# EAGLE design IMU CAN Speed Converter Board rev1 (EAGLE 9.6.2)
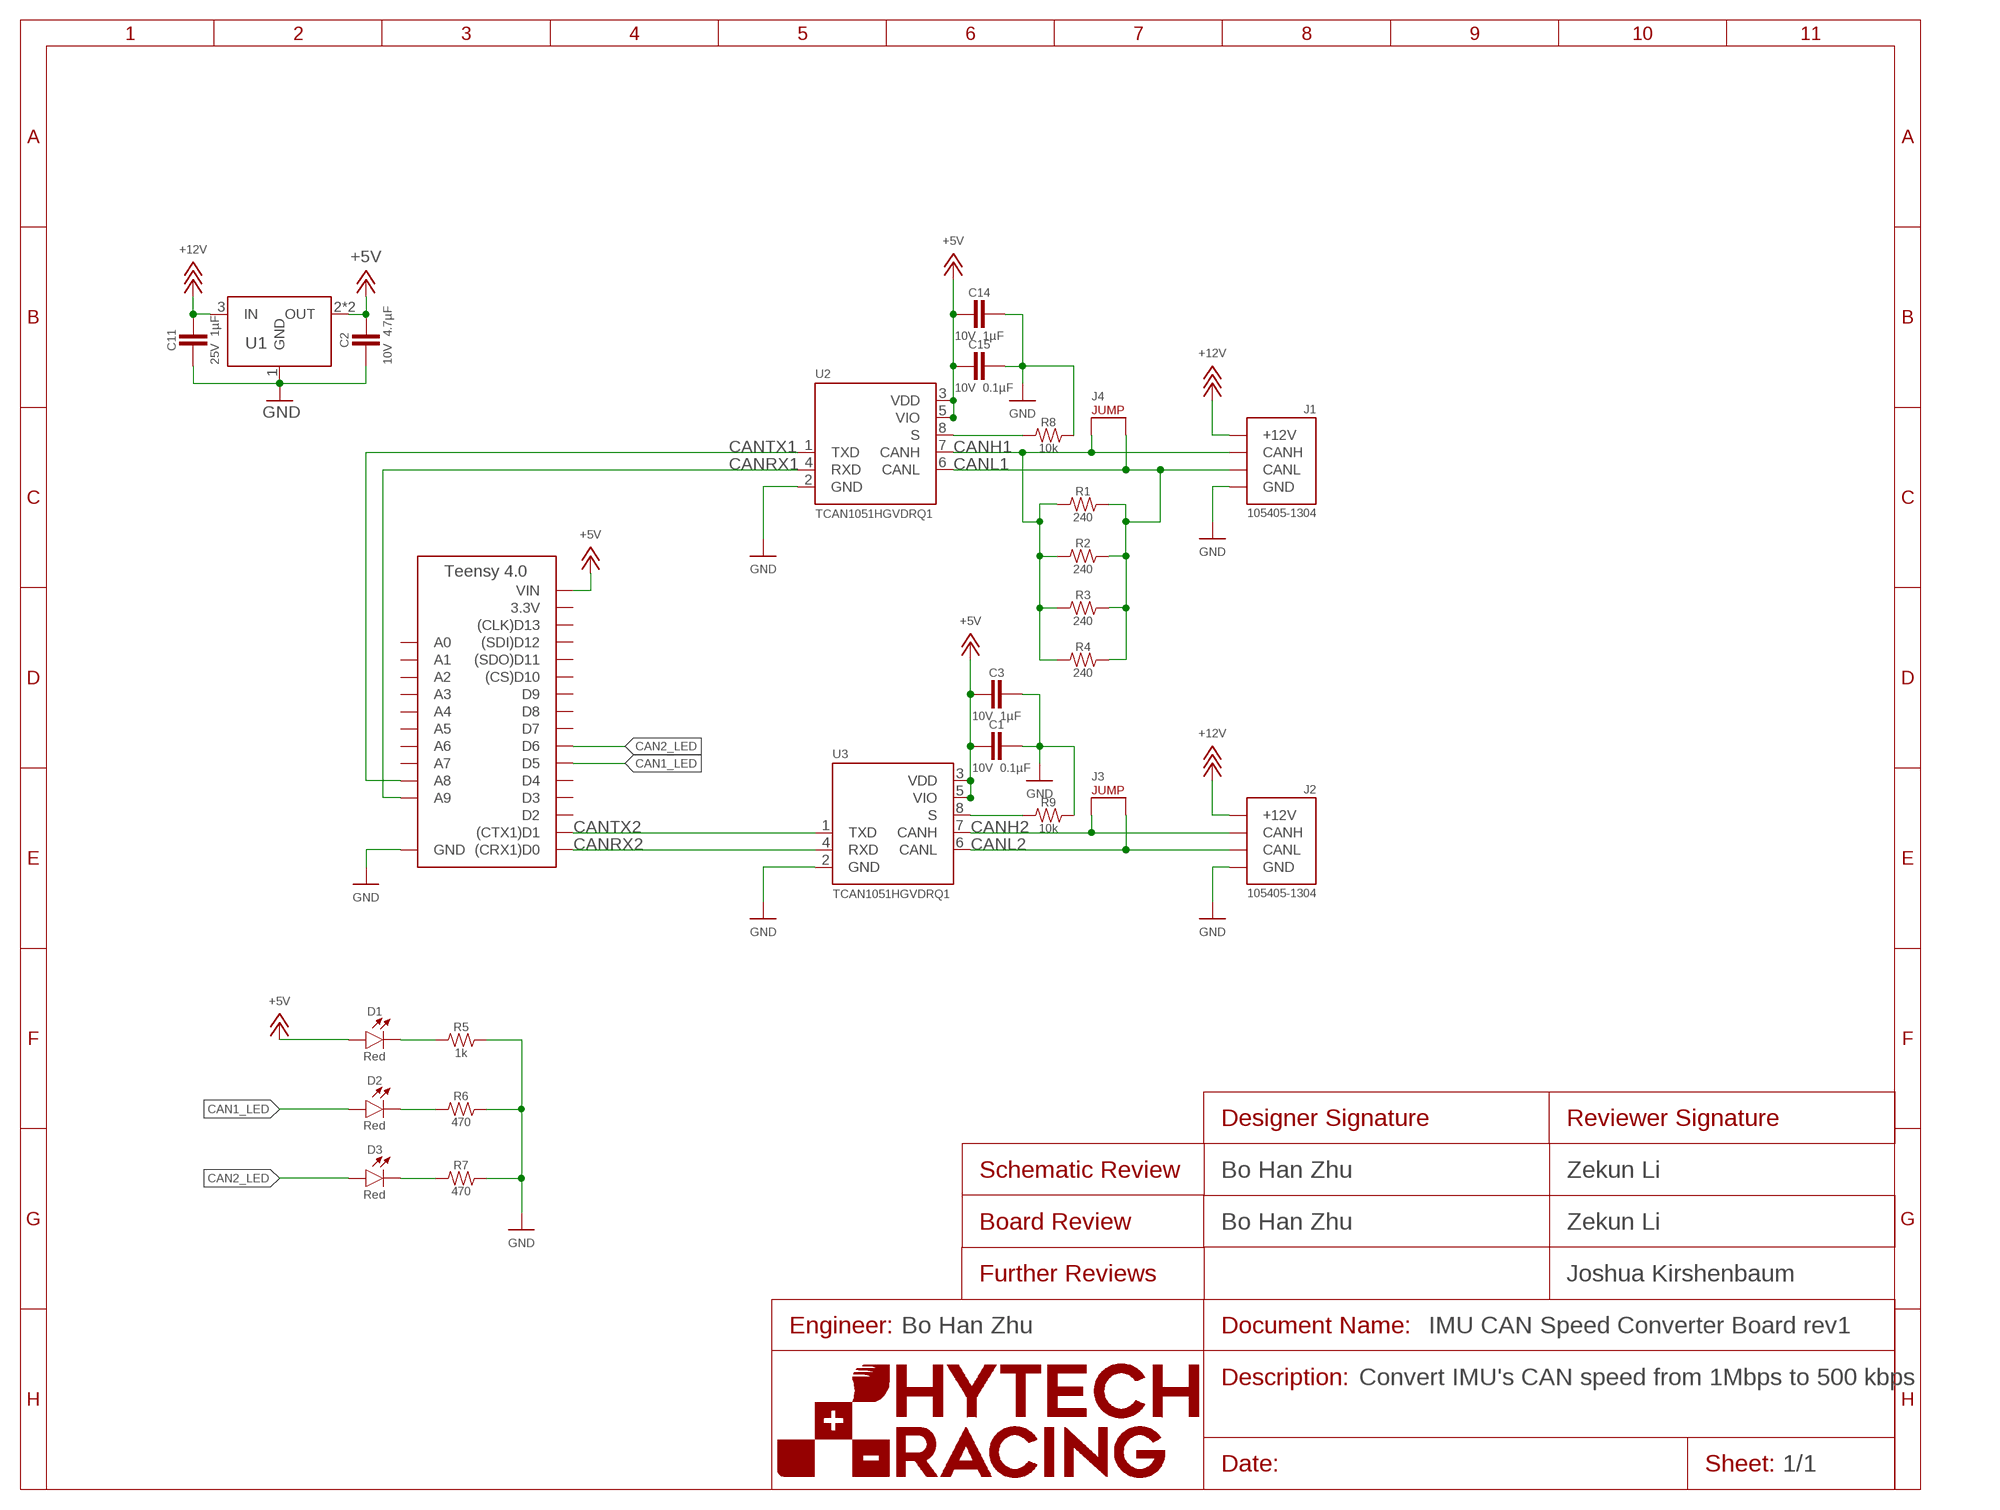
[diagram p0: schematic, sheet 1]
FRAME1 (FRAME): DESCRIPTION_1: Convert IMU's CAN speed from 1Mbps to 500 kbps; DESIGNER_BOARD: Bo Han Zhu; DESIGNER_SCHEMATIC: Bo Han Zhu; ENGINEER: Bo Han Zhu; REVIEWER_BOARD: Zekun Li; REVIEWER_FURTHER: Joshua Kirshenbaum; REVIEWER_SCHEMATIC: Zekun Li

## Parts
A1  TEENSY_4.0  [TEENSY_SHORT]
C1  CAPACITOR_0603_10V_0.1UF  [0603-CAP]
C2  CAPACITOR_0603_10V_4.7UF  [0603-CAP]
C3  CAPACITOR_0603_10V_1UF  [0603-CAP]
C11  CAPACITOR_0603_25V_1UF  [0603-CAP]
C14  CAPACITOR_0603_10V_1UF  [0603-CAP]
C15  CAPACITOR_0603_10V_0.1UF  [0603-CAP]
D1  LED_0603_RED  [0603-LED]
D2  LED_0603_RED  [0603-LED]
D3  LED_0603_RED  [0603-LED]
J1  CONNECTOR-CAN_NF_S_RA_BLACK  [MOLEX_NANOFIT_SMD_RIGHTANGLE_04]
J2  CONNECTOR-CAN_NF_S_RA_BLACK  [MOLEX_NANOFIT_SMD_RIGHTANGLE_04]
J3  JUMPER_1X02_  [1X02]
J4  JUMPER_1X02_  [1X02]
R1  RESISTOR_0603_240  [0603-RES]
R2  RESISTOR_0603_240  [0603-RES]
R3  RESISTOR_0603_240  [0603-RES]
R4  RESISTOR_0603_240  [0603-RES]
R5  RESISTOR_0603_1K  [0603-RES]
R6  RESISTOR_0603_470  [0603-RES]
R7  RESISTOR_0603_470  [0603-RES]
R8  RESISTOR_0603_10K  [0603-RES]
R9  RESISTOR_0603_10K  [0603-RES]
U1  VOLTAGE_REGULATOR_SOT223_5V  [SOT223]
U2  TCAN1051HQV-Q1  [SOIC-08(NARROW,0.15")]
U3  TCAN1051HQV-Q1  [SOIC-08(NARROW,0.15")]

## Nets
+5V: A1.VIN C1.2 C2.1 C3.2 C14.2 C15.2 D1.2(A) U1.2(OUT) U1.4(OUT) U2.3(VDD) U2.5(VIO) U3.3(VDD) U3.5(VIO)
+12V: C11.1 J1.1(+12V) J2.1(+12V) U1.3(IN)
CAN1_LED: A1.D5 D2.2(A)
CAN2_LED: A1.D6 D3.2(A)
CANH1: J1.4(CANH) J4.1 R1.1 R2.1 R3.1 R4.1 U2.7(CANH)
CANH2: J2.4(CANH) J3.1 U3.7(CANH)
CANL1: J1.3(CANL) J4.2 R1.2 R2.2 R3.2 R4.2 U2.6(CANL)
CANL2: J2.3(CANL) J3.2 U3.6(CANL)
CANRX1: A1.D23(A9) U2.4(RXD)
CANRX2: A1.D0((CRX1)D0) U3.4(RXD)
CANTX1: A1.D22(A8) U2.1(TXD)
CANTX2: A1.D1((CTX1)D1) U3.1(TXD)
GND: A1.AGND/GND(GND) A1.GND C1.1 C2.2 C3.1 C11.2 C14.1 C15.1 J1.2(GND) J2.2(GND) R5.2 R6.2 R7.2 R8.2 R9.2 U1.1(GND) U2.2(GND) U3.2(GND)
N$1: D1.1(C) R5.1
N$2: D2.1(C) R6.1
N$3: D3.1(C) R7.1
N$4: R9.1 U3.8(S)
N$5: R8.1 U2.8(S)
Unconnected: A1.D2 A1.D3 A1.D4 A1.D7 A1.D8 A1.D9 A1.D10((CS)D10) A1.D11((SDO)D11) A1.D12((SDI)D12) A1.D13((CLK)D13) A1.D14(A0) A1.D15(A1) A1.D16(A2) A1.D17(A3) A1.D18(A4) A1.D19(A5) A1.D20(A6) A1.D21(A7)

## Power pins joined to a net without a drawn wire
3.3V: A1.3.3V

## Library data of the parts
A1 = HyTechDevices:TEENSY_4.0: Teensy 4.0 Datasheet <https://www.pjrc.com/store/teensy40.html>
C1 C15 = HyTechDevices:CAPACITOR_?_*: Capacitor, Non-Polarized VJ...1BC Series Datasheet <https://www.mouser.com/datasheet/2/427/vjw1bcbascomseries-1762447.pdf> Samsung Datasheet <https://www.mouser.com/datasheet/2/585/MLCC-1837944.pdf> Walsin Datasheet <https://www.mouser.com/datasheet/2/210/WTC_MLCC_General_Purpose-1534899.pdf> GRM188R61A226ME15D <https://www.mouser.com/datasheet/2/281/1/GRM188R61A226ME15_02A-1985787.pdf> GRM188R61E106MA73D <https://www.mouser.com/datasheet/2/281/1/GRM188R61E106MA73_01A-1985806.pdf> 885012006013 <https://www.mouser.com/datasheet/2/445/885012006013-1726946.pdf> 2220Y6300105KXTWS2 <https://www.mouser.com/datasheet/2/218/SMD_High_and_Std_StackiCap_P62-1825512.pdf> Yageo Class 2, X5R <https://www.mouser.com/datasheet/2/447/UPY_GPHC_X5R_4V_to_50V_26-1827097.pdf> TDK C Series <https://www.mouser.com/ProductDetail/TDK/C3216X5R1V226M160AC?qs=%2Fha2pyFadujbcx9jh7lYl%2F4NeMoXFhdc8AqVWNq4wW6M2y7zl6GzBuhgtI0ngznN> AVX Automotive MLCC <https://www.mouser.com/datasheet/2/40/AutoMLCC-777028.pdf> KEMET X7R Series <https://www.mouser.com/datasheet/2/212/KEM_C1002_X7R_SMD-1102033.pdf>; CAPACITANCE: 0.1µF; DKPN: 720-1688-1-ND; MANUFACTURER: Vishay Vitramon; MOPN: 77-VJ0603Y104JXQPBC; MPN: VJ0603Y104JXQPW1BC; TOLERANCE: 5%; VOLTAGE: 10V
C2 = HyTechDevices:CAPACITOR_?_*: Capacitor, Non-Polarized VJ...1BC Series Datasheet <https://www.mouser.com/datasheet/2/427/vjw1bcbascomseries-1762447.pdf> Samsung Datasheet <https://www.mouser.com/datasheet/2/585/MLCC-1837944.pdf> Walsin Datasheet <https://www.mouser.com/datasheet/2/210/WTC_MLCC_General_Purpose-1534899.pdf> GRM188R61A226ME15D <https://www.mouser.com/datasheet/2/281/1/GRM188R61A226ME15_02A-1985787.pdf> GRM188R61E106MA73D <https://www.mouser.com/datasheet/2/281/1/GRM188R61E106MA73_01A-1985806.pdf> 885012006013 <https://www.mouser.com/datasheet/2/445/885012006013-1726946.pdf> 2220Y6300105KXTWS2 <https://www.mouser.com/datasheet/2/218/SMD_High_and_Std_StackiCap_P62-1825512.pdf> Yageo Class 2, X5R <https://www.mouser.com/datasheet/2/447/UPY_GPHC_X5R_4V_to_50V_26-1827097.pdf> TDK C Series <https://www.mouser.com/ProductDetail/TDK/C3216X5R1V226M160AC?qs=%2Fha2pyFadujbcx9jh7lYl%2F4NeMoXFhdc8AqVWNq4wW6M2y7zl6GzBuhgtI0ngznN> AVX Automotive MLCC <https://www.mouser.com/datasheet/2/40/AutoMLCC-777028.pdf> KEMET X7R Series <https://www.mouser.com/datasheet/2/212/KEM_C1002_X7R_SMD-1102033.pdf>; CAPACITANCE: 4.7µF; DKPN: 1276-1044-1-ND; MANUFACTURER: Samsung Electro-Mechanics; MOPN: 187-CL10A475KP8NNNC; MPN: CL10A475KP8NNNC; TOLERANCE: 10%; VOLTAGE: 10V
C3 C14 = HyTechDevices:CAPACITOR_?_*: Capacitor, Non-Polarized VJ...1BC Series Datasheet <https://www.mouser.com/datasheet/2/427/vjw1bcbascomseries-1762447.pdf> Samsung Datasheet <https://www.mouser.com/datasheet/2/585/MLCC-1837944.pdf> Walsin Datasheet <https://www.mouser.com/datasheet/2/210/WTC_MLCC_General_Purpose-1534899.pdf> GRM188R61A226ME15D <https://www.mouser.com/datasheet/2/281/1/GRM188R61A226ME15_02A-1985787.pdf> GRM188R61E106MA73D <https://www.mouser.com/datasheet/2/281/1/GRM188R61E106MA73_01A-1985806.pdf> 885012006013 <https://www.mouser.com/datasheet/2/445/885012006013-1726946.pdf> 2220Y6300105KXTWS2 <https://www.mouser.com/datasheet/2/218/SMD_High_and_Std_StackiCap_P62-1825512.pdf> Yageo Class 2, X5R <https://www.mouser.com/datasheet/2/447/UPY_GPHC_X5R_4V_to_50V_26-1827097.pdf> TDK C Series <https://www.mouser.com/ProductDetail/TDK/C3216X5R1V226M160AC?qs=%2Fha2pyFadujbcx9jh7lYl%2F4NeMoXFhdc8AqVWNq4wW6M2y7zl6GzBuhgtI0ngznN> AVX Automotive MLCC <https://www.mouser.com/datasheet/2/40/AutoMLCC-777028.pdf> KEMET X7R Series <https://www.mouser.com/datasheet/2/212/KEM_C1002_X7R_SMD-1102033.pdf>; CAPACITANCE: 1µF; DKPN: 311-1796-1-ND; MANUFACTURER: Yageo; MOPN: 603-CC603KRX7R6BB105; MPN: CC0603KRX7R6BB105; TOLERANCE: 10%; VOLTAGE: 10V
C11 = HyTechDevices:CAPACITOR_?_*: Capacitor, Non-Polarized VJ...1BC Series Datasheet <https://www.mouser.com/datasheet/2/427/vjw1bcbascomseries-1762447.pdf> Samsung Datasheet <https://www.mouser.com/datasheet/2/585/MLCC-1837944.pdf> Walsin Datasheet <https://www.mouser.com/datasheet/2/210/WTC_MLCC_General_Purpose-1534899.pdf> GRM188R61A226ME15D <https://www.mouser.com/datasheet/2/281/1/GRM188R61A226ME15_02A-1985787.pdf> GRM188R61E106MA73D <https://www.mouser.com/datasheet/2/281/1/GRM188R61E106MA73_01A-1985806.pdf> 885012006013 <https://www.mouser.com/datasheet/2/445/885012006013-1726946.pdf> 2220Y6300105KXTWS2 <https://www.mouser.com/datasheet/2/218/SMD_High_and_Std_StackiCap_P62-1825512.pdf> Yageo Class 2, X5R <https://www.mouser.com/datasheet/2/447/UPY_GPHC_X5R_4V_to_50V_26-1827097.pdf> TDK C Series <https://www.mouser.com/ProductDetail/TDK/C3216X5R1V226M160AC?qs=%2Fha2pyFadujbcx9jh7lYl%2F4NeMoXFhdc8AqVWNq4wW6M2y7zl6GzBuhgtI0ngznN> AVX Automotive MLCC <https://www.mouser.com/datasheet/2/40/AutoMLCC-777028.pdf> KEMET X7R Series <https://www.mouser.com/datasheet/2/212/KEM_C1002_X7R_SMD-1102033.pdf>; CAPACITANCE: 1µF; DKPN: 1276-1184-1-ND; MANUFACTURER: Samsung Electro-Mechanics; MOPN: 187-CL10B105KA8NNNC; MPN: CL10B105KA8NNNC; TOLERANCE: 10%; VOLTAGE: 25V
D1-D3 = HyTechDevices:LED_?_*: LED Blue <https://www.mouser.com/datasheet/2/216/APT1608VBC_D-246010.pdf> Green <https://www.mouser.com/datasheet/2/216/APT1608ZGCK-1173388.pdf> Orange <https://www.mouser.com/datasheet/2/216/APT1608SECK-6197.pdf> Red <https://www.mouser.com/datasheet/2/216/APT1608SECK-J3-PRV-1173336.pdf> White <https://www.mouser.com/datasheet/2/50/SM0603UWC-880813.pdf> Yellow <https://www.mouser.com/datasheet/2/216/APT1608SYCK-J3-PRV-1173311.pdf>; COLOR: Red; DKPN: 754-1786-1-ND; MANUFACTURER: Kingbright; MOPN: 604-APT1608SECKJ3PRV; MPN: APT1608SECK/J3-PRV
J1 J2 = HyTechDevices:CONNECTOR-CAN_?_*: HyTech CAN Connector; MANUFACTURER: Molex; MPN: 105405-1304
J3 J4 = HyTechDevices:JUMPER_?_*: 2 Pin Connector
R1-R4 = HyTechDevices:RESISTOR_?_*: Resistor PWR163 Series <https://www.mouser.com/datasheet/2/54/pwr163-777985.pdf> AC Series <https://www.mouser.com/datasheet/2/447/Yageo_PYu_AC_51_RoHS_L_7_1714230-1874691.pdf> PU Series <https://www.mouser.com/datasheet/2/447/PYu-PU_51_RoHS_L_6-1504619.pdf> ERA Series <https://www.mouser.com/datasheet/2/315/AOA0000C307-1149632.pdf> PWR263 Series <https://www.mouser.com/datasheet/2/54/pwr263s_35-778069.pdf> RC Series <https://www.mouser.com/datasheet/2/447/Yageo_03_18_2021_PYu_RC_Group_51_RoHS_L_11-2199992.pdf> ERJ PB3, PB6 Series <https://www.mouser.com/datasheet/2/315/AOA0000C328-1530132.pdf> ERJ PA2, P03, PA3, P06, P08, P14 Series <https://www.mouser.com/datasheet/2/315/AOA0000C331-1141874.pdf>; DKPN: 311-240HRCT-ND; MANUFACTURER: Yageo; MOPN: 603-RC0603FR-07240RL; MPN: RC0603FR-07240RL; POWER: 0.1W; RESISTANCE: 240; TOLERANCE: 1%; VOLTAGE_CONTINUOUS: 4.90V; VOLTAGE_MAX: 75V
R5 = HyTechDevices:RESISTOR_?_*: Resistor PWR163 Series <https://www.mouser.com/datasheet/2/54/pwr163-777985.pdf> AC Series <https://www.mouser.com/datasheet/2/447/Yageo_PYu_AC_51_RoHS_L_7_1714230-1874691.pdf> PU Series <https://www.mouser.com/datasheet/2/447/PYu-PU_51_RoHS_L_6-1504619.pdf> ERA Series <https://www.mouser.com/datasheet/2/315/AOA0000C307-1149632.pdf> PWR263 Series <https://www.mouser.com/datasheet/2/54/pwr263s_35-778069.pdf> RC Series <https://www.mouser.com/datasheet/2/447/Yageo_03_18_2021_PYu_RC_Group_51_RoHS_L_11-2199992.pdf> ERJ PB3, PB6 Series <https://www.mouser.com/datasheet/2/315/AOA0000C328-1530132.pdf> ERJ PA2, P03, PA3, P06, P08, P14 Series <https://www.mouser.com/datasheet/2/315/AOA0000C331-1141874.pdf>; DKPN: 311-1.00KHRCT-ND; MANUFACTURER: Yageo; MOPN: 603-RC0603FR-071KL; MPN: RC0603FR-071KL; POWER: 0.1W; RESISTANCE: 1k; TOLERANCE: 1%; VOLTAGE_CONTINUOUS: 10.00V; VOLTAGE_MAX: 75V
R6 R7 = HyTechDevices:RESISTOR_?_*: Resistor PWR163 Series <https://www.mouser.com/datasheet/2/54/pwr163-777985.pdf> AC Series <https://www.mouser.com/datasheet/2/447/Yageo_PYu_AC_51_RoHS_L_7_1714230-1874691.pdf> PU Series <https://www.mouser.com/datasheet/2/447/PYu-PU_51_RoHS_L_6-1504619.pdf> ERA Series <https://www.mouser.com/datasheet/2/315/AOA0000C307-1149632.pdf> PWR263 Series <https://www.mouser.com/datasheet/2/54/pwr263s_35-778069.pdf> RC Series <https://www.mouser.com/datasheet/2/447/Yageo_03_18_2021_PYu_RC_Group_51_RoHS_L_11-2199992.pdf> ERJ PB3, PB6 Series <https://www.mouser.com/datasheet/2/315/AOA0000C328-1530132.pdf> ERJ PA2, P03, PA3, P06, P08, P14 Series <https://www.mouser.com/datasheet/2/315/AOA0000C331-1141874.pdf>; DKPN: P470BYCT-ND; MANUFACTURER: Panasonic Electronic Components; MOPN: 667-ERJ-PA3F4700V; MPN: ERJ-PA3F4700V; POWER: 0.25W; RESISTANCE: 470; TOLERANCE: 1%; VOLTAGE_CONTINUOUS: 10.84V; VOLTAGE_MAX: 150V
R8 R9 = HyTechDevices:RESISTOR_?_*: Resistor PWR163 Series <https://www.mouser.com/datasheet/2/54/pwr163-777985.pdf> AC Series <https://www.mouser.com/datasheet/2/447/Yageo_PYu_AC_51_RoHS_L_7_1714230-1874691.pdf> PU Series <https://www.mouser.com/datasheet/2/447/PYu-PU_51_RoHS_L_6-1504619.pdf> ERA Series <https://www.mouser.com/datasheet/2/315/AOA0000C307-1149632.pdf> PWR263 Series <https://www.mouser.com/datasheet/2/54/pwr263s_35-778069.pdf> RC Series <https://www.mouser.com/datasheet/2/447/Yageo_03_18_2021_PYu_RC_Group_51_RoHS_L_11-2199992.pdf> ERJ PB3, PB6 Series <https://www.mouser.com/datasheet/2/315/AOA0000C328-1530132.pdf> ERJ PA2, P03, PA3, P06, P08, P14 Series <https://www.mouser.com/datasheet/2/315/AOA0000C331-1141874.pdf>; DKPN: 311-10.0KHRCT-ND; MANUFACTURER: Yageo; MOPN: 603-RC0603FR-0710KL; MPN: RC0603FR-0710KL; POWER: 0.1W; RESISTANCE: 10k; TOLERANCE: 1%; VOLTAGE_CONTINUOUS: 31.62V; VOLTAGE_MAX: 75V
U1 = HyTechDevices:VOLTAGE_REGULATOR_?_*: Voltage Regulators LDL1117S50R Datasheet <https://www.mouser.com/datasheet/2/389/dm00366442-1799212.pdf> NCP785AH120T1G <https://www.mouser.com/datasheet/2/308/NCP785A_D-1812704.pdf>; DKPN: 497-17240-1-ND; MANUFACTURER: STMicroelectronics; MOPN: 511-LDL1117S50R; MPN: LDL1117S50R
U2 U3 = HyTechDevices:TCAN1051*V-Q1: TCAN1051*V Can Tranciever Datasheet <https://www.ti.com/lit/ds/symlink/tcan1051hgv-q1.pdf?HQS=dis-mous-null-mousermode-dsf-pf-null-wwe&ts=1610765132518&ref_url=https%253A%252F%252Fwww.mouser.com%252Ff>; DKPN: 296-49935-1-ND; MANUFACTURER: Texas Instruments; MOPN: 595-TCAN1051HGVDQ1; MPN: TCAN1051HGVDRQ1

## Board
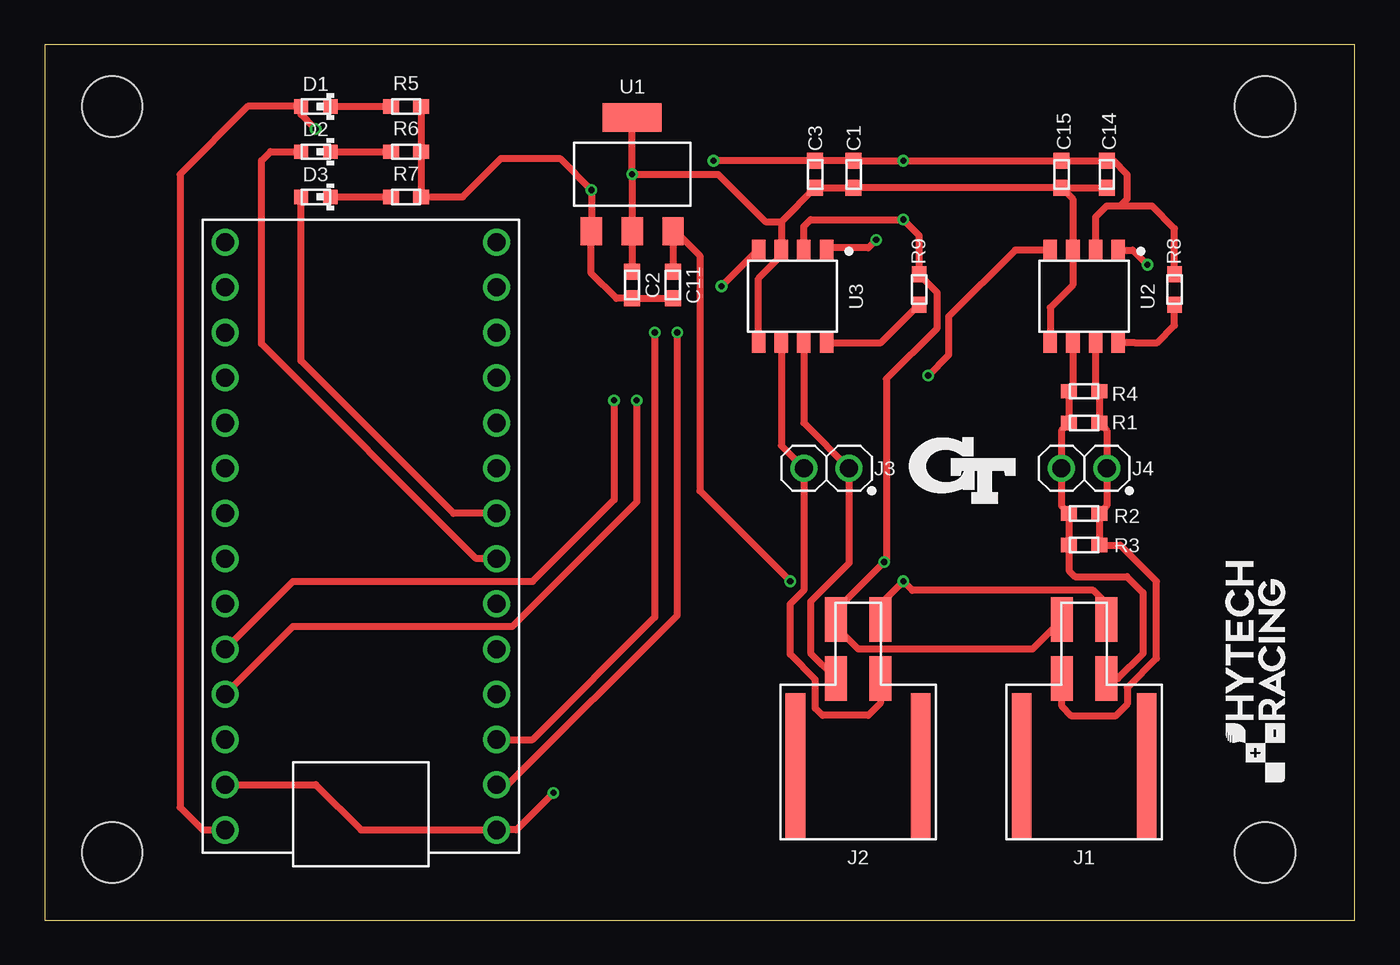
[diagram p1: board, top side]
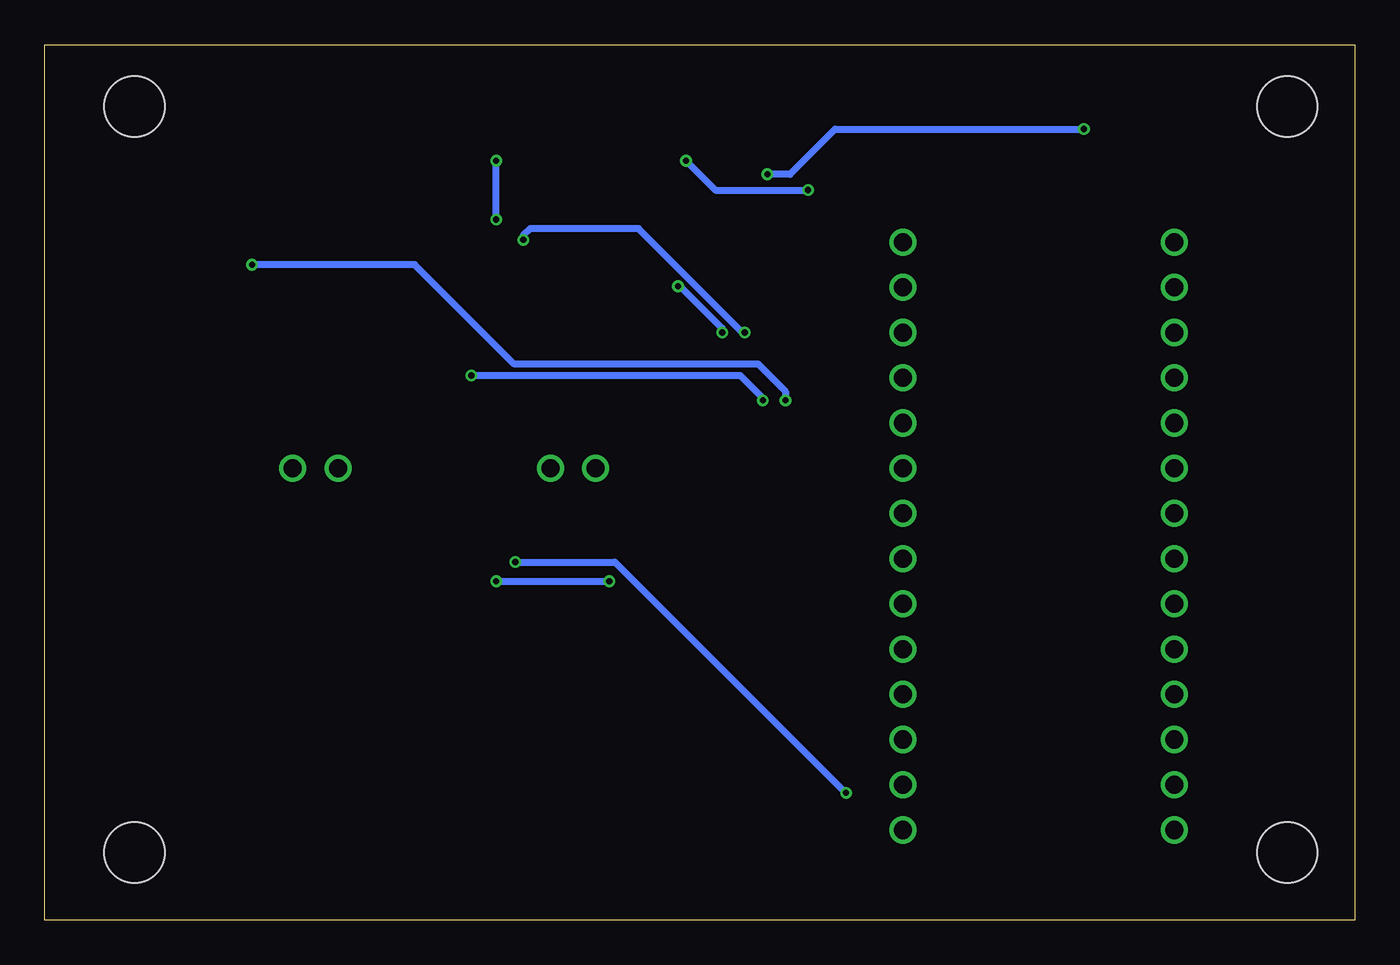
[diagram p2: board, bottom side, seen from below]

Size 73.64 x 49.2 mm. Coordinates in mm from the lower left corner, seen from the top.
Outline: 0,0 73.64,0 73.64,49.2 0,49.2 0,0
Copper layers (1*16): Top 0.035mm / dielectric 1.53mm / Bottom 0.035mm
Design rules "JLCPCB (2 Layer)": minimum track width 5mil, minimum drill 0.3mm, track to track 5mil, track to pad 5mil, pad to pad 5mil, via to via 20mil, smd to smd 5mil, copper to edge 0.2mm, drill to drill 21mil, minimum pad ring 6mil, minimum via ring 6mil, stop-mask expansion 6mil, vias tented up to drill 30mil, thermal gap 10mil

### Footprints (pad centres in the part's own frame; a part is rotated, then mirrored left to right if it is on the bottom)
TEENSY_SHORT = drill 1.016: 3.3V 0,5.08; AGND/GND 0,2.54; D0 15.24,2.54; D1 15.24,5.08; D2 15.24,7.62; D3 15.24,10.16; D4 15.24,12.7; D5 15.24,15.24; D6 15.24,17.78; D7 15.24,20.32; D8 15.24,22.86; D9 15.24,25.4; D10 15.24,27.94; D11 15.24,30.48; D12 15.24,33.02; D13 0,33.02; D14 0,30.48; D15 0,27.94; D16 0,25.4; D17 0,22.86; D18 0,20.32; D19 0,17.78; D20 0,15.24; D21 0,12.7; D22 0,10.16; D23 0,7.62; GND 15.24,0; VIN 0,0
0603-CAP = smd 0.9 x 0.9: 1 -0.75,0; 2 0.75,0
0603-LED = smd 0.8 x 0.8: 1 -0.825,0; 2 0.825,0
MOLEX_NANOFIT_SMD_RIGHTANGLE_04 = smd 1.24 x 2.5: 1 1.25,1.65; 2 -1.25,1.65; 3 1.25,-1.65; 4 -1.25,-1.65 | smd 1.1 x 8.2: PAD1 -3.52,-6.58; PAD@1 3.52,-6.58
1X02 = drill 1.016: 1 -1.27,0; 2 1.27,0
0603-RES = smd 0.9 x 0.8: 1 -0.85,0; 2 0.85,0
SOT223 = smd 1.2 x 1.6: 1 -2.3,-3.2; 2 0,-3.2; 3 2.3,-3.2 | smd 3.3 x 1.6: 4 0,3.2
SOIC-08(NARROW,0.15") = smd 0.762 x 1.143: 1 -1.905,-2.603; 2 -0.635,-2.603; 3 0.635,-2.603; 4 1.905,-2.603; 5 1.905,2.603; 6 0.635,2.603; 7 -0.635,2.603; 8 -1.905,2.603
MOUNTING_M3 = hole 3.4: 0,0

### Placement (x,y rotation side)
A1  10.16,5.08 0 top
C1  45.47,41.91 270 top
C2  33.02,35.69 270 top
C3  43.31,41.91 270 top
C11  35.31,35.69 270 top
C14  59.69,41.91 270 top
C15  57.15,41.91 270 top
D1  15.24,45.72 180 top
D2  15.24,43.18 180 top
D3  15.24,40.64 180 top
J1  58.42,15.24 0 top
J2  45.72,15.24 0 top
J3  43.94,25.4 180 top
J4  58.42,25.4 180 top
R1  58.42,27.94 180 top
R2  58.42,22.86 180 top
R3  58.42,21.08 180 top
R4  58.42,29.72 180 top
R5  20.32,45.72 0 top
R6  20.32,43.18 0 top
R7  20.32,40.64 0 top
R8  63.5,35.43 90 top
R9  49.15,35.43 90 top
U1  33.02,41.91 0 top
U2  58.42,35.05 180 top
U3  42.04,35.05 180 top
U$1  [MOUNTING_M3]  68.58,3.81 0 top
U$2  [MOUNTING_M3]  3.81,45.72 0 top
U$3  [LOGO_HYTECH_0.5"]  69.85,7.62 90 top
U$4  [MOUNTING_M3]  3.81,3.81 0 top
U$5  [MOUNTING_M3]  68.58,45.72 0 top
U$6  [LOGO_GT_0.25"]  51.56,25.27 0 top

### Tracks (layer width: path | path; a pad name or v marks a point on that pad's centre or on a via)
+5V  (via drill 0.35)
  Top 0.381: C15.2 C14.2 | C15.2 57.78,40.52 U2.3 57.78,35.69 56.52,34.42 U2.5 | 41.4,39.26 C3.2 C1.2 C15.2 | 41.4,39.26 U3.3 41.56,37.5 40.13,36.07 U3.5 | A1.VIN 8.89,5.08 7.62,6.35 7.62,41.91 11.43,45.72 D1.2 14.41,45.27 v15.24,44.45 | v33.02,41.91 U1.4 | v33.02,41.91 U1.2 C2.1 | v33.02,41.91 37.85,41.91 40.5,39.26 41.4,39.26
  Bottom 0.381: v15.24,44.45 29.21,44.45 31.75,41.91 v33.02,41.91
+12V  (via drill 0.35)
  Top 0.381: J2.1 46.97,17.76 v48.26,19.05 48.77,18.54 58.93,18.54 59.69,17.78 59.67,17.76 J1.1 | v41.91,19.05 36.83,24.13 36.83,37.34 35.46,38.71 U1.3 35.32,36.45 C11.1
  Bottom 0.381: v48.26,19.05 v41.91,19.05
CAN1_LED
  Top 0.381: A1.D5 24.26,20.32 12.19,32.38 12.19,42.67 12.7,43.18 D2.2
CAN2_LED
  Top 0.381: A1.D6 22.99,22.86 14.41,31.43 D3.2
CANH1
  Top 0.381: U2.7 59.05,29.93 R4.1 R1.1 59.69,27.52 J4.1 59.69,23.28 R2.1 R3.1 60.45,21.08 62.48,19.05 62.48,14.72 60.84,13.08 60.84,12.15 60.17,11.48 57.71,11.48 57.17,12.02 J1.4
CANH2
  Top 0.381: U3.7 42.67,27.94 J3.1 45.21,20.07 43.05,17.91 43.05,15.01 J2.4
CANL1
  Top 0.381: U2.6 57.78,29.93 R4.2 R1.2 57.15,27.52 J4.2 57.15,23.28 R2.2 R3.2 57.57,19.65 57.91,19.3 60.83,19.3 61.72,18.41 61.72,14.99 60.33,13.59 J1.3
CANL2
  Top 0.381: U3.6 41.4,26.67 J3.2 42.67,18.54 41.91,17.78 41.91,14.94 43.32,13.53 43.32,11.91 43.72,11.51 46.29,11.51 46.97,12.19 J2.3
CANRX1  (via drill 0.35)
  Top 0.381: A1.D23 13.97,16.51 26.29,16.51 33.27,23.5 v33.27,29.21 | v49.66,30.61 50.8,31.75 50.8,33.91 54.55,37.66 U2.4
  Bottom 0.381: v33.27,29.21 33.27,29.34 34.54,30.61 v49.66,30.61
CANRX2  (via drill 0.35)
  Top 0.381: A1.D0 26.04,7.62 35.56,17.14 v35.56,33.02 | v38.04,35.62 40.07,37.66 U3.4
  Bottom 0.381: v35.56,33.02 35.56,33.27 37.97,35.69 v38.04,35.62
CANTX1  (via drill 0.35)
  Top 0.381: A1.D22 13.97,19.05 27.43,19.05 32,23.62 v32,29.21 | U2.1 61.15,37.66 v61.98,36.83
  Bottom 0.381: v32,29.21 32,29.72 33.53,31.24 47.24,31.24 52.83,36.83 v61.98,36.83
CANTX2  (via drill 0.35)
  Top 0.381: A1.D1 27.43,10.16 34.29,17.02 v34.29,33.02 | U3.1 44.07,37.78 46.29,37.78 v46.74,38.23
  Bottom 0.381: v34.29,33.02 34.42,33.02 40.26,38.86 46.35,38.86 46.74,38.48 v46.74,38.23
GND  (via drill 0.35)
  Top 0.381: J1.2 55.53,15.25 45.71,15.25 44.47,16.49 J2.2 44.47,17.42 v47.18,20.13 47.31,20.26 47.31,30.42 50.16,33.27 50.16,35.27 R9.2 49.15,38.48 v48.26,39.37 43.05,39.37 42.67,38.99 U3.2 | 60.45,40.13 60.83,40.51 60.83,41.91 60.08,42.66 C14.1 C15.1 57.14,42.67 v48.26,42.67 48.25,42.66 C1.1 C3.1 37.6,42.66 v37.59,42.67 | 60.45,40.13 59.69,40.13 59.05,39.5 U2.2 | 60.45,40.13 62.23,40.13 63.5,38.86 R8.2 | R5.2 R6.2 R7.2 23.5,40.64 25.65,42.8 28.96,42.8 v30.73,41.02 30.73,38.72 U1.1 30.72,36.35 32.13,34.94 C2.2 C11.2 | A1.AGND/GND 15.24,7.62 17.78,5.08 A1.GND 26.52,5.08 v28.6,7.16
  Bottom 0.381: v47.18,20.13 41.59,20.13 28.63,7.16 v28.6,7.16 | v48.26,39.37 v48.26,42.67 | v37.59,42.67 35.94,41.02 v30.73,41.02
N$1
  Top 0.381: D1.1 R5.1
N$2
  Top 0.381: D2.1 R6.1
N$3
  Top 0.381: D3.1 R7.1
N$4
  Top 0.381: U3.8 47.01,32.45 R9.1
N$5
  Top 0.381: U2.8 60.96,32.45 61.24,32.45 62.52,32.45 63.5,33.43 R8.1

### Text on the board
tDocu: HyTech Racing 2022 / IMU CAN Speed Converter rev1 / Designed by Bo Han Zhu | Connect to Vehicle CAN-Bus | Connect to IMU